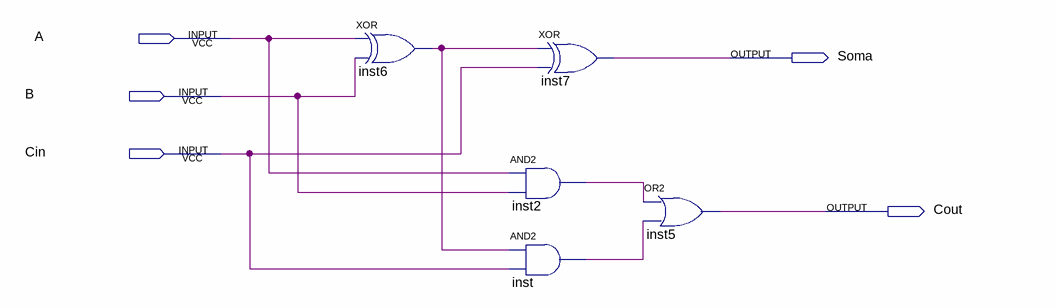
[diagram p0: schematic sheet]
// Quartus schematic Somador.bdf as structural Verilog: 5 symbols, 5 pins
module Somador (
  input  A,
  input  B,
  input  Cin,
  output Soma,
  output Cout
);

  wire inst2_out, inst6_out, inst_out;

  xor inst6 (inst6_out, A, B);
  xor inst7 (Soma, inst6_out, Cin);
  and inst2 (inst2_out, A, B);
  and inst (inst_out, inst6_out, Cin);
  or inst5 (Cout, inst2_out, inst_out);
endmodule
